# EAGLE schematic SmartSteirs_Base (EAGLE 7.0.0)
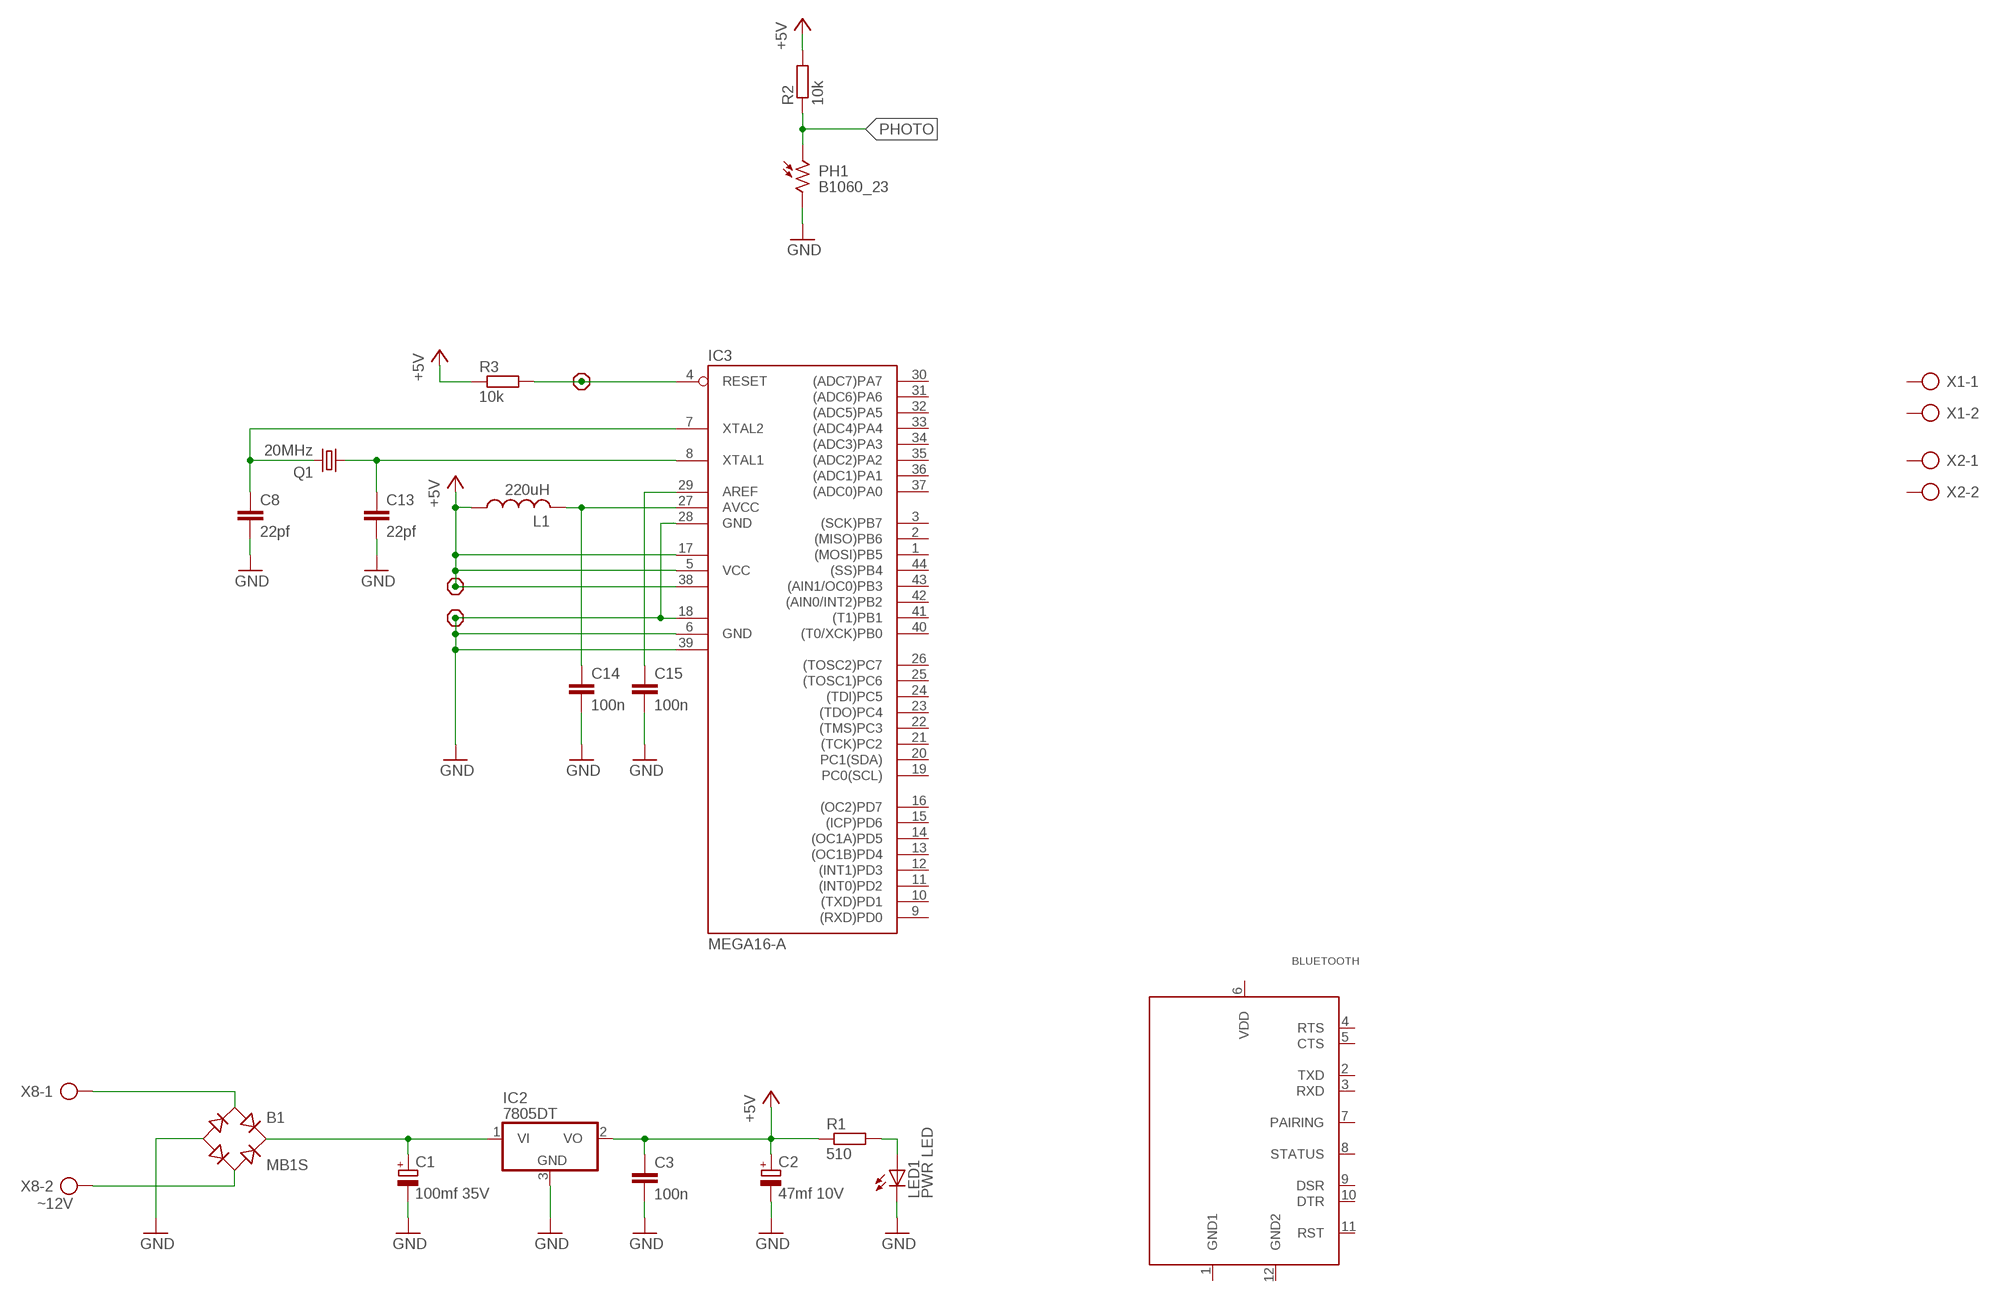
[diagram p0: schematic, sheet 1]

## Parts
B1  MB1S  [SOIC-4]
BLUETOOTH  ESD110ESD110  [ESD110]
C1  100mf 35V  CPOL-EUE2.5-6  [E2,5-6]
C2  47mf 10V  CPOL-EUE2.5-6  [E2,5-6]
C3  100n  C-EUC0805  [C0805]
C8  22pf  C-EUC0805  [C0805]
C13  22pf  C-EUC0805  [C0805]
C14  100n  C-EUC0805  [C0805]
C15  100n  C-EUC0805  [C0805]
IC2  7805DT  [TO252]
IC3  MEGA16-A  [TQFP44]
JP13  PIN_1  [1X01]
JP14  PIN_1  [1X01]
JP15  PIN_1  [1X01]
L1  220uH  L-US0207/5V  [0207/5V]
LED1  PWR LED  LED3MM  [LED3MM]
PH1  B1060_23  [TO-8_B10]
Q1  20MHz  CRYSTALHC49S  [HC49/S]
R1  510  R-EU_M0805  [M0805]
R2  10k  R-EU_M0805  [M0805]
R3  10k  R-EU_M0805  [M0805]
X1  AK500/2  [AK500/2]
X2  AK500/2  [AK500/2]
X8  ~12V  AK500/2  [AK500/2]

## Nets
+5V: C2.+ C3.1 IC2.2(VO) IC3.5(VCC) IC3.17(VCC1) IC3.38(VCC2) JP15.1 L1.1 R1.1 R2.2 R3.1
GND: B1.- C1.- C2.- C3.2 C8.2 C13.2 C14.2 C15.2 IC2.3(GND) IC3.6(GND) IC3.18(GND1) IC3.28(GND) IC3.39(GND2) JP14.1 LED1.K(C) PH1.2
N$1: LED1.A R1.2
N$3: B1.+ C1.+ IC2.1(VI)
N$6: B1.~2(AC2) X8.2
N$8: B1.~1(AC1) X8.1
N$17: C8.1 IC3.7(XTAL2) Q1.2
N$18: C13.1 IC3.8(XTAL1) Q1.1
N$19: IC3.4(RESET) JP13.1 R3.2
N$20: C15.1 IC3.29(AREF)
N$22: C14.1 IC3.27(AVCC) L1.2
PHOTO: PH1.1 R2.1
Unconnected: BLUETOOTH.1(GND1) BLUETOOTH.2(TXD) BLUETOOTH.3(RXD) BLUETOOTH.4(RTS) BLUETOOTH.5(CTS) BLUETOOTH.6(VDD) BLUETOOTH.7(PAIRING) BLUETOOTH.8(STATUS) BLUETOOTH.9(DSR) BLUETOOTH.10(DTR) BLUETOOTH.11(RST) BLUETOOTH.12(GND2) IC3.1((MOSI)PB5) IC3.2((MISO)PB6) IC3.3((SCK)PB7) IC3.9((RXD)PD0) IC3.10((TXD)PD1) IC3.11((INT0)PD2) IC3.12((INT1)PD3) IC3.13((OC1B)PD4) IC3.14((OC1A)PD5) IC3.15((ICP)PD6) IC3.16((OC2)PD7) IC3.19(PC0(SCL)) IC3.20(PC1(SDA)) IC3.21((TCK)PC2) IC3.22((TMS)PC3) IC3.23((TDO)PC4) IC3.24((TDI)PC5) IC3.25((TOSC1)PC6) IC3.26((TOSC2)PC7) IC3.30((ADC7)PA7) IC3.31((ADC6)PA6) IC3.32((ADC5)PA5) IC3.33((ADC4)PA4) IC3.34((ADC3)PA3) IC3.35((ADC2)PA2) IC3.36((ADC1)PA1) IC3.37((ADC0)PA0) IC3.40((T0/XCK)PB0) IC3.41((T1)PB1) IC3.42((AIN0/INT2)PB2) IC3.43((AIN1/OC0)PB3) IC3.44((SS)PB4) X1.1 X1.2 X2.1 X2.2

## Library data of the parts
B1 = rectifier:MB*S: Bridge Rectifier Source: http://www.fairchildsemi.com/ds/MB/MB6S.pdf
BLUETOOTH = sena_technology-bluetooth:ESD110: ESD110 Blue-Tooth Module
C1 C2 = rcl:CPOL-EU: POLARIZED CAPACITOR, European symbol
C3 C8 C13-C15 = rcl:C-EU: CAPACITOR, European symbol
IC2 = linear:78*: Positive VOLTAGE REGULATOR Source: http://cache.national.com/ds/LM/LM78L05.pdf http://www.fairchildsemi.com/ds/LM/LM7805.pdf
IC3 = atmel:MEGA16: MICROCONTROLLER 16 Kbytes FLASH 1 kbytes SRAM 512 bytes EEPROM USART 8-channel 10 bit ADC Source: avr.lbr; MPN: ATMEGA16-16AU; OC_FARNELL: 9171134; OC_NEWARK: 96K6515
JP13-JP15 = pinhead:PIN_1
L1 = rcl:L-US: INDUCTOR, American symbol
LED1 = led:LED: LED OSRAM: - CHIPLED LG R971, LG N971, LY N971, LG Q971, LY Q971, LO R971, LY R971 LH N974, LH R974 LS Q976, LO Q976, LY Q976 LO Q996 - Hyper CHIPLED LW Q18S LB Q993, LB Q99A, LB R99A - SideLED LS A670, LO A670, LY A670, LG A670, LP A670 LB A673, LV A673, LT A673, LW A673 LH A674 LY A675 LS A676, LA A676, LO A676, LY A676, LW A676 LS A679, LY A679, LG A679 - Hyper Micro SIDELED® LS Y876, LA Y876, LO Y876, LY Y876 LT Y87S - SmartLED LW L88C, LW L88S LB L89C, LB L89S, LG L890 LS L89K, LO L89K, LY L89K LS L896, LA L896, LO L896, LY L896 - TOPLED LS T670, LO T670, LY T670, LG T670, LP T670 LSG T670, LSP T670, LSY T670, LOP T670, LYG T670 LG T671, LOG T671, LSG T671 LB T673, LV T673, LT T673, LW T673 LH T674 LS T676, LA T676, LO T676, LY T676, LB T676, LH T676, LSB T676, LW T676 LB T67C, LV T67C, LT T67C, LS T67K, LO T67K, LY T67K, LW E67C LS E67B, LA E67B, LO E67B, LY E67B, LB E67C, LV E67C, LT E67C LW T67C LS T679, LY T679, LG T679 LS T770, LO T770, LY T770, LG T770, LP T770 LB T773, LV T773, LT T773, LW T773 LH T774 LS E675, LA E675, LY E675, LS T675 LS T776, LA T776, LO T776, LY T776, LB T776 LHGB T686 LT T68C, LB T68C - Hyper Mini TOPLED® LB M676 - Mini TOPLED Santana® LG M470 LS M47K, LO M47K, LY M47K Source: http://www.osram.convergy.de LUXEON: - LUMILED® LXK2-PW12-R00, LXK2-PW12-S00, LXK2-PW14-U00, LXK2-PW14-V00 LXK2-PM12-R00, LXK2-PM12-S00, LXK2-PM14-U00 LXK2-PE12-Q00, LXK2-PE12-R00, LXK2-PE12-S00, LXK2-PE14-T00, LXK2-PE14-U00 LXK2-PB12-K00, LXK2-PB12-L00, LXK2-PB12-M00, LXK2-PB14-N00, LXK2-PB14-P00, LXK2-PB14-Q00 LXK2-PR12-L00, LXK2-PR12-M00, LXK2-PR14-Q00, LXK2-PR14-R00 LXK2-PD12-Q00, LXK2-PD12-R00, LXK2-PD12-S00 LXK2-PH12-R00, LXK2-PH12-S00 LXK2-PL12-P00, LXK2-PL12-Q00, LXK2-PL12-R00 Source: www.luxeon.com KINGBRIGHT: KA-3528ASYC Source: www.kingbright.com
PH1 = photo-elements:?1060*: Sensor Street Light control Source: http://optoelectronics.perkinelmer.com/content/Datasheets/DTS_PhotocellsB1060.pdf
Q1 = crystal:CRYSTAL: CRYSTAL; OC_FARNELL: 1667008; OC_NEWARK: unknown
R1-R3 = rcl:R-EU_: RESISTOR, European symbol
X1 X2 X8 = con-ptr500:AK500/2: CONNECTOR; OC_FARNELL: unknown; OC_NEWARK: unknown